# Altium schematic sheet eVV_Radio.SchDoc: eVV_Radio
size A4; DrawnBy: Ivica Matovic; Revision: 1.1; SheetNumber: 6; SheetTotal: 8
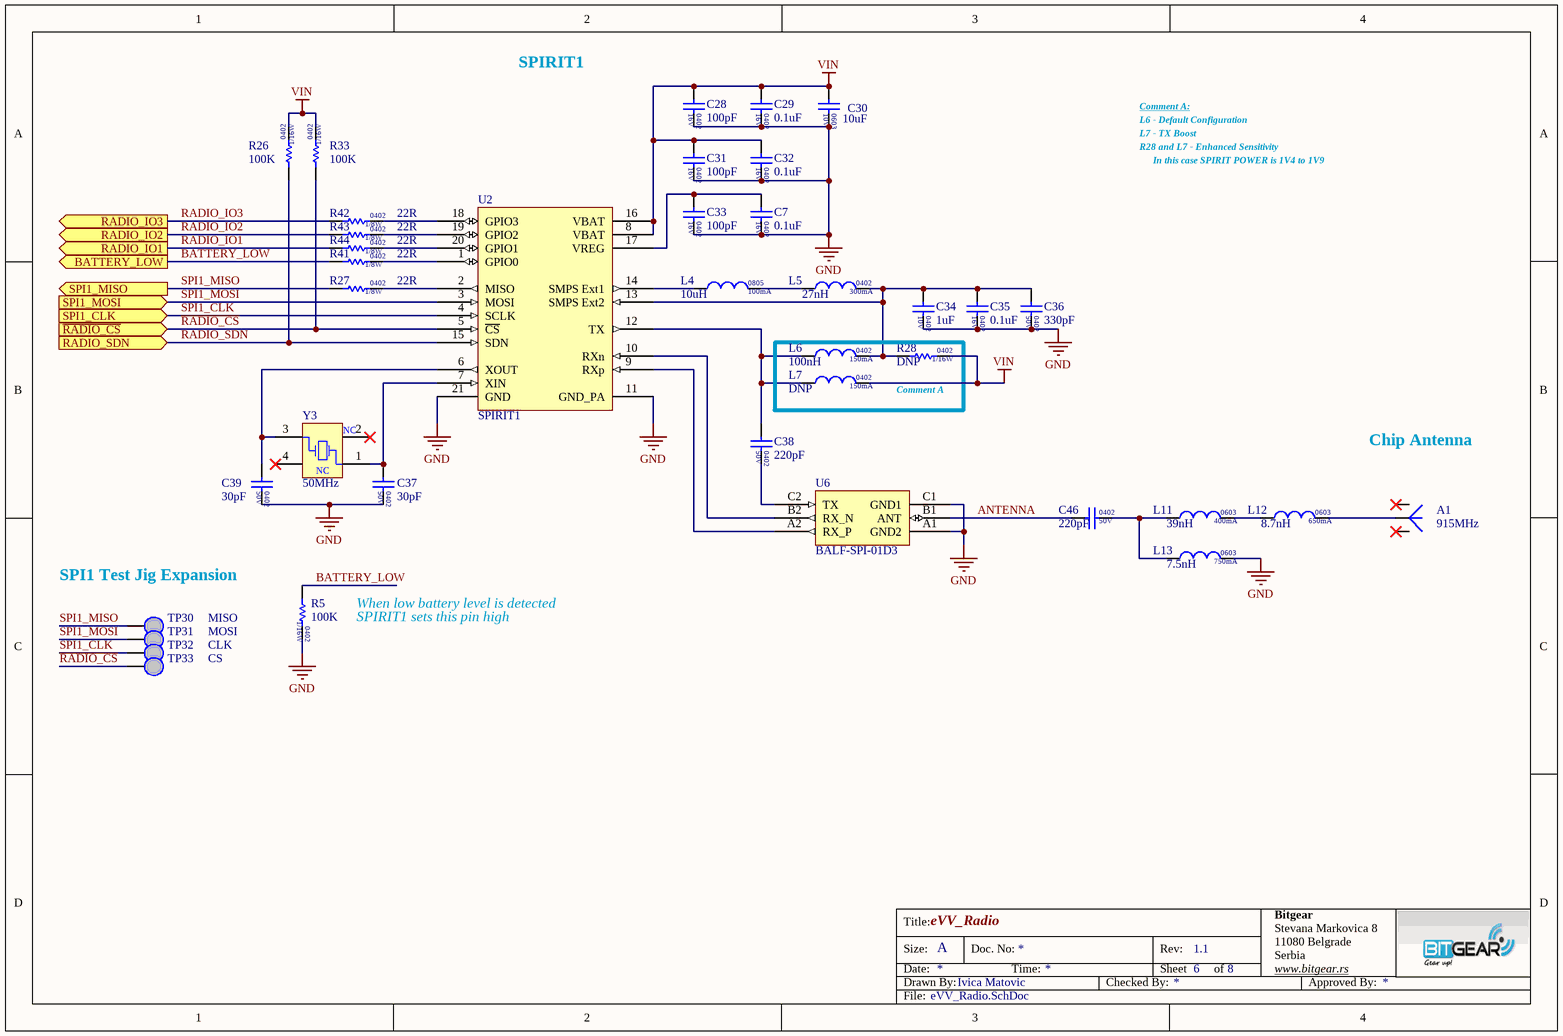
[diagram p0: eVV_Radio.SchDoc]

## Parts
A1  915MHz  [MITSUBISHI_AM11DG-ST01]
C7  0.1uF  [CAPC1005X60N]
C28  100pF  [CAPC1005X60N]
C29  0.1uF  [CAPC1005X60N]
C30  10uF  [CAPC1608X95N]
C31  100pF  [CAPC1005X60N]
C32  0.1uF  [CAPC1005X60N]
C33  100pF  [CAPC1005X60N]
C34  1uF  [CAPC1005X60N]
C35  0.1uF  [CAPC1005X60N]
C36  330pF  [CAPC1005X60N]
C37  30pF  [CAPC1005X60N]
C38  220pF  [CAPC1005X60N]
C39  30pF  [CAPC1005X60N]
C46  220pF  [CAPC1005X60N]
L4  10uH  [INDC2012X85N]
L5  27nH  [INDC1005X60N]
L6  100nH  [INDC1005X60N]
L7  DNP  [INDC1005X60N]
L11  39nH  [MURATA_LQW18A]
L12  8.7nH  [MURATA_LQW18A]
L13  7.5nH  [MURATA_LQW18A]
R5  100K  [RESC1005X40AN]
R26  100K  [RESC1005X40AN]
R27  22R  [RESC1005X40AN]
R28  DNP  [RESC1005X40AN]
R33  100K  [RESC1005X40AN]
R41  22R  [RESC1005X40AN]
R42  22R  [RESC1005X40AN]
R43  22R  [RESC1005X40AN]
R44  22R  [RESC1005X40AN]
TP30  MISO  [TEST_POINT_1MM]  (no BOM)
TP31  MOSI  [TEST_POINT_1MM]  (no BOM)
TP32  CLK  [TEST_POINT_1MM]  (no BOM)
TP33  CS  [TEST_POINT_1MM]  (no BOM)
U2  SPIRIT1  [QFN50P400X400X100-21N]
U6  BALF-SPI-01D3  [STM_BALF_SPI]
Y3  50MHz  [AVX_CX3225GB50]

## Blocks framed on the sheet
Comment A: L6 L7 R28

## Ports
BATTERY_LOW (out), RADIO_IO1 (out), RADIO_IO2 (out), RADIO_IO3 (out), RADIO_SDN (in), SPI1_CLK (in), SPI1_MISO (out), SPI1_MOSI (in), ~{RADIO_CS} (in)

## Nets
GND: C7.2 C28.2 C29.2 C30.2 C31.2 C32.2 C33.2 C34.2 C35.2 C36.2 C37.2 C39.2 L13.2 R5.1 U2.11(GND_PA) U2.21(GND) U6.A1(GND2) U6.C1(GND1)
VIN: C28.1 C29.1 C30.1 C31.1 C32.1 L7.2 R26.1 R28.1 R33.1 U2.8(VBAT) U2.16(VBAT)
ANTENNA: C46.1 U6.B1(ANT)
BATTERY_LOW: R5.2 R41.2 ; port BATTERY_LOW
~{RADIO_CS}: R33.2 TP33.1 U2.5(~{CS}) ; port ~{RADIO_CS}
RADIO_IO1: R44.2 ; port RADIO_IO1
RADIO_IO2: R43.2 ; port RADIO_IO2
RADIO_IO3: R42.2 ; port RADIO_IO3
RADIO_SDN: R26.2 U2.15(SDN) ; port RADIO_SDN
SPI1_CLK: TP32.1 U2.4(SCLK) ; port SPI1_CLK
SPI1_MISO: R27.2 TP30.1 ; port SPI1_MISO
SPI1_MOSI: TP31.1 U2.3(MOSI) ; port SPI1_MOSI
NetA1_1: A1.1 L12.2
NetC7_1: C7.1 C33.1 U2.17(VREG)
NetC34_1: C34.1 C35.1 C36.1 L5.2 L6.2 R28.2 U2.13(SMPS_Ext2)
NetC37_1: C37.1 U2.7(XIN) Y3.1(OSC1)
NetC38_1: C38.1 L6.1 L7.1 U2.12(TX)
NetC38_2: C38.2 U6.C2(TX)
NetC39_1: C39.1 U2.6(XOUT) Y3.3(OSC2)
NetC46_2: C46.2 L11.1 L13.1
NetL4_1: L4.1 U2.14(SMPS_Ext1)
NetL4_2: L4.2 L5.1
NetL11_2: L11.2 L12.1
NetR27_1: R27.1 U2.2(MISO)
NetR41_1: R41.1 U2.1(GPIO0)
NetR42_1: R42.1 U2.18(GPIO3)
NetR43_1: R43.1 U2.19(GPIO2)
NetR44_1: R44.1 U2.20(GPIO1)
NetU2_9: U2.9(RXp) U6.A2(RX_P)
NetU2_10: U2.10(RXn) U6.B2(RX_N)

Not connected (* = marked no-connect by the designer): A1 2* 3*; Y3 2(NC)* 4(NC)*

## Notes on the sheet
- SPIRIT1
- Comment A:
- L6 - Default Configuration
- L7 - TX Boost
- R28 and L7 - Enhanced Sensitivity
- In this case SPIRIT POWER is 1V4 to 1V9
- Chip Antenna
- SPI1 Test Jig Expansion
- When low battery level is detected
- SPIRIT1 sets this pin high
- Title:
- Bitgear
- Size:
- Date:
- Drawn By:
- A
- Doc. No:
- Time:
- Checked By:
- Sheet
- Rev:
- of
- Stevana Markovica 8
- 11080 Belgrade
- Serbia
- www.bitgear.rs
- Approved By:
- File:
- (in symbol Cap-1005 (0402) CER 0.1UF 16V X7R 10%) 16V
- (in symbol Cap-1005 (0402) CER 1uF 10V X5R 10%) 10V
- (in symbol Cap-1005 (0402) CER 30pF 50V NP0 5%) 50V
- (in symbol Cap-1005 (0402) CER 100PF 16V C0G 10%) 16V
- (in symbol Cap-1005 (0402) CER 220pF 50V C0G 5%) 50V
- (in symbol Cap-1005 (0402) CER 330pF 50V C0G 5%) 50V
- (in symbol Cap-1608 (0603) CER 10uF 10V X5R 20%) 10V
- (in symbol Ind-1005 (0402) 27nH 300mA 5%) 300mA
- (in symbol Ind-1005 (0402) 100nH 150mA 5%) 150mA
- (in symbol Ind-1608 (0603) 7.5nH 750mA 0.5nH) 0603; 750mA
- (in symbol Ind-1608 (0603) 8.7nH 650mA 0.5nH) 0603; 650mA
- (in symbol Ind-1608 (0603) 39nH 400mA 2%) 0603; 400mA
- (in symbol Ind-2012 (0805) 10uH 100mA 20%) 100mA
- (in symbol Res-1005 (0402) 0 Ohm 1/16W) 0402; 1/16W
- (in symbol Res-1005 (0402) 22 Ohm 1/8W 1%) 0402; 1/8W
- (in symbol Res-1005 (0402) 100 KOhm 1/16W 1%) 1/16W; 0402

## Library data of the parts
A1 = AM11DG-ST01: Mitscubishi SMD Chip Antenna 3.0X10.5mm; Manufacturer: Mitsubishi Materials; D P/N: TBD; S MOQ: 10000; Distributor: TBD; D Price: TBD; M P/N: AM11DG-ST01; Mounting: SMD; Package: 0402; Value: 915MHz
C7 C29 C32 C35 = Cap-1005 (0402) CER 0.1UF 16V X7R 10%: CAP CER 0.1UF 0402 (1005) 16V X7R 10%; Manufacturer: Murata Electronics North America; D P/N: 490-3261-1-ND; D Price: 0.1; M P/N: GRM155R71C104KA88D; S MOQ: 10000; S P/N: 490-3261-2-ND; S Price: 0.00462; Distributor: Digikey; Mounting: SMD; Supplier: Digi Key; Package: 0402; Value: 0.1uF
C28 C31 C33 = Cap-1005 (0402) CER 100PF 16V C0G 10%: CAP CER 100PF 0402 (1005) 16V C0G 10%; Manufacturer: Kemet; D P/N: 399-7749-1-ND; D Price: 0.1; M P/N: C0402C101K4GACTU; S MOQ: 10000; S P/N: 399-7749-2-ND; S Price: 0.00294; Distributor: Digikey; Mounting: SMD; Supplier: Digi Key; Package: 0402; Value: 100pF
C30 = Cap-1608 (0603) CER 10uF 10V X5R 20%: Capacitor Ceramic 10uF 1608 (0603) 10V X5R 20%; Manufacturer: Taiyo Yuden; D P/N: 587-3412-1-ND; D Price: 0.4; M P/N: LMK107BBJ106MAHT; S MOQ: 4000; S P/N: 587-3412-2-ND; S Price: 0.08296; Distributor: Digikey; Mounting: SM; Supplier: Digi Key; Package: 0603; Value: 10uF
C34 = Cap-1005 (0402) CER 1uF 10V X5R 10%: Manufacturer: Murata Electronics North America; D P/N: 490-3890-1-ND; D Price: 0.18; M P/N: GRM155R61A105KE15D; S MOQ: 10000; S P/N: 490-3890-2-ND; S Price: 0.01323; Distributor: Digikey; Mounting: SMD; Supplier: Digi Key; Package: 0402; Value: 1uF
C36 = Cap-1005 (0402) CER 330pF 50V C0G 5%: Manufacturer: Murata Electronics North America; D P/N: 490-8200-1-ND; D Price: 0.1; M P/N: GRM1555C1H331JA01J; S MOQ: 1000; S Price: 0.0174; Distributor: Digikey; Mounting: SMD; S P/N: 490-8200-1-ND; Supplier: Digi Key; Package: 0402; Value: 330pF
C37 C39 = Cap-1005 (0402) CER 30pF 50V NP0 5%: CAP CER 30PF 50V 5% NP0 0402 (1005); Manufacturer: Murata Electronics North America; D P/N: 490-5935-1-ND; D Price: 0.1; M P/N: GRM1555C1H300JA01D; S MOQ: 1000; S Price: 0.0117; Distributor: Digikey; Mounting: SM; S P/N: 490-5935-1-ND; Supplier: Digi Key; Package: 0402; Value: 30pF
C38 C46 = Cap-1005 (0402) CER 220pF 50V C0G 5%: Manufacturer: Murata Electronics North America; D P/N: 490-1293-1-ND; D Price: 0.15; M P/N: GRM1555C1H221JA01D; S MOQ: 10000; S P/N: 490-1293-2-ND; S Price: 0.00819; Distributor: Digikey; Mounting: SMD; Supplier: Digi Key; Package: 0402; Value: 220pF
L4 = Ind-2012 (0805) 10uH 100mA 20%: Inductor 10uH 100mA 20% 0805 SMD; Manufacturer: Murata; D P/N: 490-4029-1-ND; D Price: 0.17; M P/N: LQM21FN100M70L; S MOQ: 3000; S P/N: 490-4029-2-ND; S Price: 0.05418; Distributor: Digikey; Mounting: SMD; Supplier: Digi Key; Package: 0805; Value: 10uH
L5 = Ind-1005 (0402) 27nH 300mA 5%: Inductor 27nH 300mA 5% 0402 SMD; Manufacturer: Murata Electronics North America; D P/N: 490-1090-1-ND; D Price: 0.1; M P/N: LQG15HN27NJ02D; S MOQ: 10000; S P/N: 490-1090-2-ND; S Price: 0.01872; Distributor: Digikey; Mounting: SMD; Supplier: Digi Key; Package: 0402; Value: 27nH
L6 L7 = Ind-1005 (0402) 100nH 150mA 5%: Inductor 100nH 150mA 5% 0402 SMD; Manufacturer: Murata Electronics North America; D P/N: 490-2635-1-ND; D Price: 0.1; M P/N: LQG15HSR10J02D; S MOQ: 10000; S P/N: 490-2635-2-ND; S Price: 0.02208; Distributor: Digikey; Mounting: SMD; Supplier: Digi Key; Package: 0402; Value: 100nH
L11 = Ind-1608 (0603) 39nH 400mA 2%: Inductor 39nH 400mA 2% 0603 SMD Wirewound; Manufacturer: Murata Electronics North America; D P/N: 490-6888-1-ND; D Price: 0.36; M P/N: LQW18AN39NG00D; S MOQ: 4000; S P/N: 490-6888-2-ND; S Price: 0.1224; Value: 39nH Wirewound; Distributor: Digikey; Mounting: SMD; Supplier: Digi Key; Package: 0402
L12 = Ind-1608 (0603) 8.7nH 650mA 0.5nH: Inductor 8.7nH 650mA 0.5nH 0603 SMD Wirewound; Manufacturer: Murata Electronics North America; D P/N: 490-1168-1-ND; D Price: 0.33; M P/N: LQW18AN8N7D00D; S MOQ: 4000; S P/N: 490-1168-2-ND; S Price: 0.11189; Value: 8.7n Wirewound; Distributor: Digikey; Mounting: SMD; Supplier: Digi Key; Package: 0402
L13 = Ind-1608 (0603) 7.5nH 750mA 0.5nH: Inductor 7.5nH 750mA 0.5nH 0603 SMD Wirewound; Manufacturer: Murata Electronics North America; D P/N: 490-1166-1-ND; D Price: 0.33; M P/N: LQW18AN7N5D00D; S MOQ: 4000; S P/N: 490-1166-2-ND; S Price: 0.11186; Value: 7.5nH Wirewound; Distributor: Digikey; Mounting: SMD; Supplier: Digi Key; Package: 0402
R5 R26 R33 = Res-1005 (0402) 100 KOhm 1/16W 1%: Manufacturer: Vishay Dale; D P/N: 311-100KLRCT-ND; D Price: 0.1; M P/N: RC0402FR-07100KL; S MOQ: 10000; S P/N: 311-100KLRTR-ND; S Price: 0.00152; Distributor: Digikey; Mounting: SM; Supplier: Digi Key; Value: 100K
R27 R41-R44 = Res-1005 (0402) 22 Ohm 1/8W 1%: Manufacturer: Vishay Dale; D P/N: 541-22.0YCT-ND; D Price: 0.020; M P/N: CRCW040222R0FKEDHP; S MOQ: 10000; S P/N: 541-22.0YTR-ND; S Price: 0.02376; Distributor: Digikey; Mounting: SM; Supplier: Digi Key; Value: 22R
R28 = Res-1005 (0402) 0 Ohm 1/16W: Manufacturer: Stackpole Electronics Inc; D P/N: RMCF0402ZT0R00; D Price: 0.020; M P/N: RMCF0402ZT0R00CT-ND; S MOQ: 10000; S P/N: RMCF0402ZT0R00TR-ND; S Price: 0.00132; Value: 0R; Distributor: Digikey; Mounting: SM; Supplier: Digi Key
TP30-TP33 = TP: Test point; D P/N: TESTP; D Price: 0; M P/N: TESTP; Mounting: SM
U2 = SPIRIT1: Low data rate, low power sub-1GHZ transceiver; Manufacturer: ST Microelectronics; M P/N: SPIRIT1QTR; D P/N: 497-13383-1-ND; D Price: 1.53; S P/N: 497-13383-2-ND; S MOQ: 45000; S Price: 1.32; Mounting: SMD; Distributor: Digikey; Supplier: Digi Key
U6 = BALF-SPI-01D3: 50 Ohm Balun to Spirit1 With Integrated Harmonic Filter; Manufacturer: ST Microelectronics; D P/N: 497-13985-1-ND; D Price: 0.74; S P/N: 497-13985-2-ND; S MOQ: 5000 No Stock; S Price: 0.243; Mounting: SMD; M P/N: BALF-SPI-01D3; Distributor: Digikey; Supplier: Digi Key
Y3 = CX3225GB50: Crystal 50.000MHZ 3.2mm x 2.5mm 18pF; Manufacturer: AVX Corp.; D P/N: 1253-1228-1-ND; D Price: 0.74; M P/N: CX3225GB50000P0HPQCC; S MOQ: 1000; S Price: 0.43; Distributor: Digikey; Mounting: SM; S P/N: 1253-1228-1-ND; Supplier: Digi Key; Package: 4-SMD; Value: 50MHz